# Altium schematic sheet 06_POWER_4.SchDoc
size 420 x 297 mm; SheetNumber: 10; SheetTotal: 35
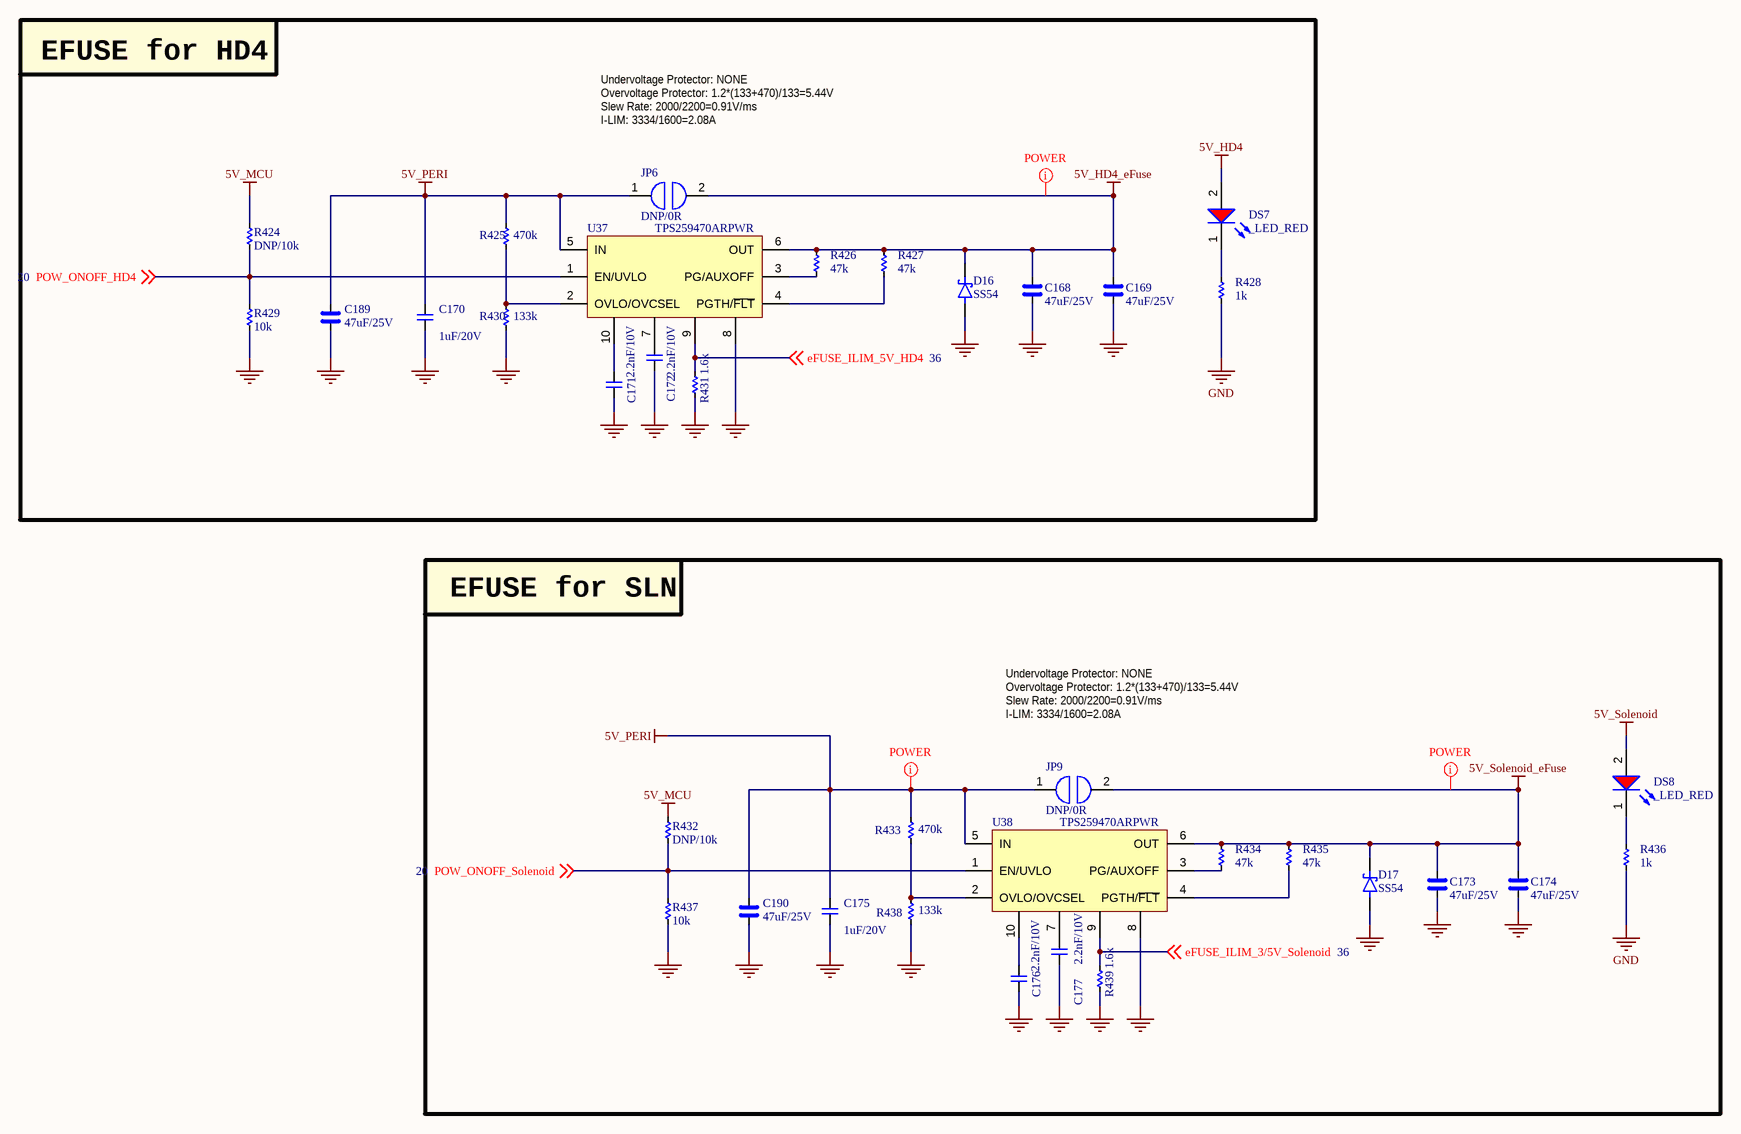
[diagram p0: 06_POWER_4.SchDoc]

## Parts
C168  47uF/25V  [CAP_C_3225X80]
C169  47uF/25V  [CAP_C_3225X80]
C170  1uF/20V  [CAP_C_1005X60]
C171  2.2nF/10V  [CAP_C_1005X60]
C172  2.2nF/10V  [CAP_C_1005X60]
C173  47uF/25V  [CAP_C_3225X80]
C174  47uF/25V  [CAP_C_3225X80]
C175  1uF/20V  [CAP_C_1005X60]
C176  2.2nF/10V  [CAP_C_1005X60]
C177  2.2nF/10V  [CAP_C_1005X60]
C189  47uF/25V  [CAP_C_3225X80]
C190  47uF/25V  [CAP_C_3225X80]
D16  SS54  [DO-214AC_SMA]
D17  SS54  [DO-214AC_SMA]
DS7  _LED_RED  [LED_0603]
DS8  _LED_RED  [LED_0603]
JP6  DNP/0R  [JUMPER_1608]
JP9  DNP/0R  [JUMPER_1608]
R424  DNP/10k  [RES_C_1005X40]
R425  470k  [RES_C_1005X40]
R426  47k  [RES_C_1005X40]
R427  47k  [RES_C_1005X40]
R428  1k  [RES_C_1005X40]
R429  10k  [RES_C_1005X40]
R430  133k  [RES_C_1005X40]
R431  1.6k  [RES_C_1005X40]
R432  DNP/10k  [RES_C_1005X40]
R433  470k  [RES_C_1005X40]
R434  47k  [RES_C_1005X40]
R435  47k  [RES_C_1005X40]
R436  1k  [RES_C_1005X40]
R437  10k  [RES_C_1005X40]
R438  133k  [RES_C_1005X40]
R439  1.6k  [RES_C_1005X40]
U37  TPS259470ARPWR  [VQFN-HR-10]
U38  TPS259470ARPWR  [VQFN-HR-10]

## Blocks framed on the sheet
EFUSE for HD4: C168-C172 C189 D16 DS7 JP6 R424-R431 U37
EFUSE for SLN: C173-C177 C190 D17 DS8 JP9 R432-R439 U38

## Nets
5V_HD4: DS7.2(A)
5V_HD4_eFuse: C168.2 C169.2 D16.1(K) JP6.2 R426.2 R427.2 U37.6(OUT)
5V_MCU: R424.1 R432.1
5V_PERI: C170.2 C175.2 C189.2 C190.2 JP6.1 JP9.1 R425.2 R433.2 U37.5(IN) U38.5(IN)
5V_Solenoid: DS8.2(A)
5V_Solenoid_eFuse: C173.2 C174.2 D17.1(K) JP9.2 R434.2 R435.2 U38.6(OUT)
GND: C168.1 C169.1 C170.1 C171.1 C172.1 C173.1 C174.1 C175.1 C176.1 C177.1 C189.1 C190.1 D16.2(A) D17.2(A) R428.1 R429.2 R430.1 R431.1 R436.1 R437.2 R438.1 R439.1 U37.8 U38.8
eFUSE_ILIM_3/5V_Solenoid: R439.2 U38.9 ; off-sheet eFUSE_ILIM_3/5V_Solenoid
eFUSE_ILIM_5V_HD4: R431.2 U37.9 ; off-sheet eFUSE_ILIM_5V_HD4
POW_ONOFF_HD4: R424.2 R429.1 U37.1(EN/UVLO) ; off-sheet POW_ONOFF_HD4
POW_ONOFF_Solenoid: R432.2 R437.1 U38.1(EN/UVLO) ; off-sheet POW_ONOFF_Solenoid
NetC171_2: C171.2 U37.10
NetC172_2: C172.2 U37.7
NetC176_2: C176.2 U38.10
NetC177_2: C177.2 U38.7
NetDS7_1: DS7.1(K) R428.2
NetDS8_1: DS8.1(K) R436.2
NetR425_1: R425.1 R430.2 U37.2(OVLO/OVCSEL)
NetR426_1: R426.1 U37.3(PG/AUXOFF)
NetR427_1: R427.1 U37.4(PGTH/~{FLT})
NetR433_1: R433.1 R438.2 U38.2(OVLO/OVCSEL)
NetR434_1: R434.1 U38.3(PG/AUXOFF)
NetR435_1: R435.1 U38.4(PGTH/~{FLT})

## Layout directives
net class POWER: 5V_HD4_eFuse, 5V_PERI, 5V_Solenoid_eFuse

## Notes on the sheet
- Undervoltage Protector: NONE
- Overvoltage Protector: 1.2*(133+470)/133=5.44V
- Slew Rate: 2000/2200=0.91V/ms
- I-LIM: 3334/1600=2.08A
- Project:
- Sub-system:
- Design by:
- Sheet title:
- Sheet
- of
- Checked by:
- Approved by:
- Revision:
- Document No:
- Size:
- Date:
- A3

## Library data of the parts
C168 C169 C173 C174 C189 C190 = _CAP_C_High_2: CAP High Value
C170-C172 C175-C177 = _CAP_C_2: CAP
D16 D17 = DIODE SCHOTTKY
JP6 JP9 = JUMPER
R424-R439 = _RES_B_2: RES